# EAGLE design p2c-001 (EAGLE 9.6.2)
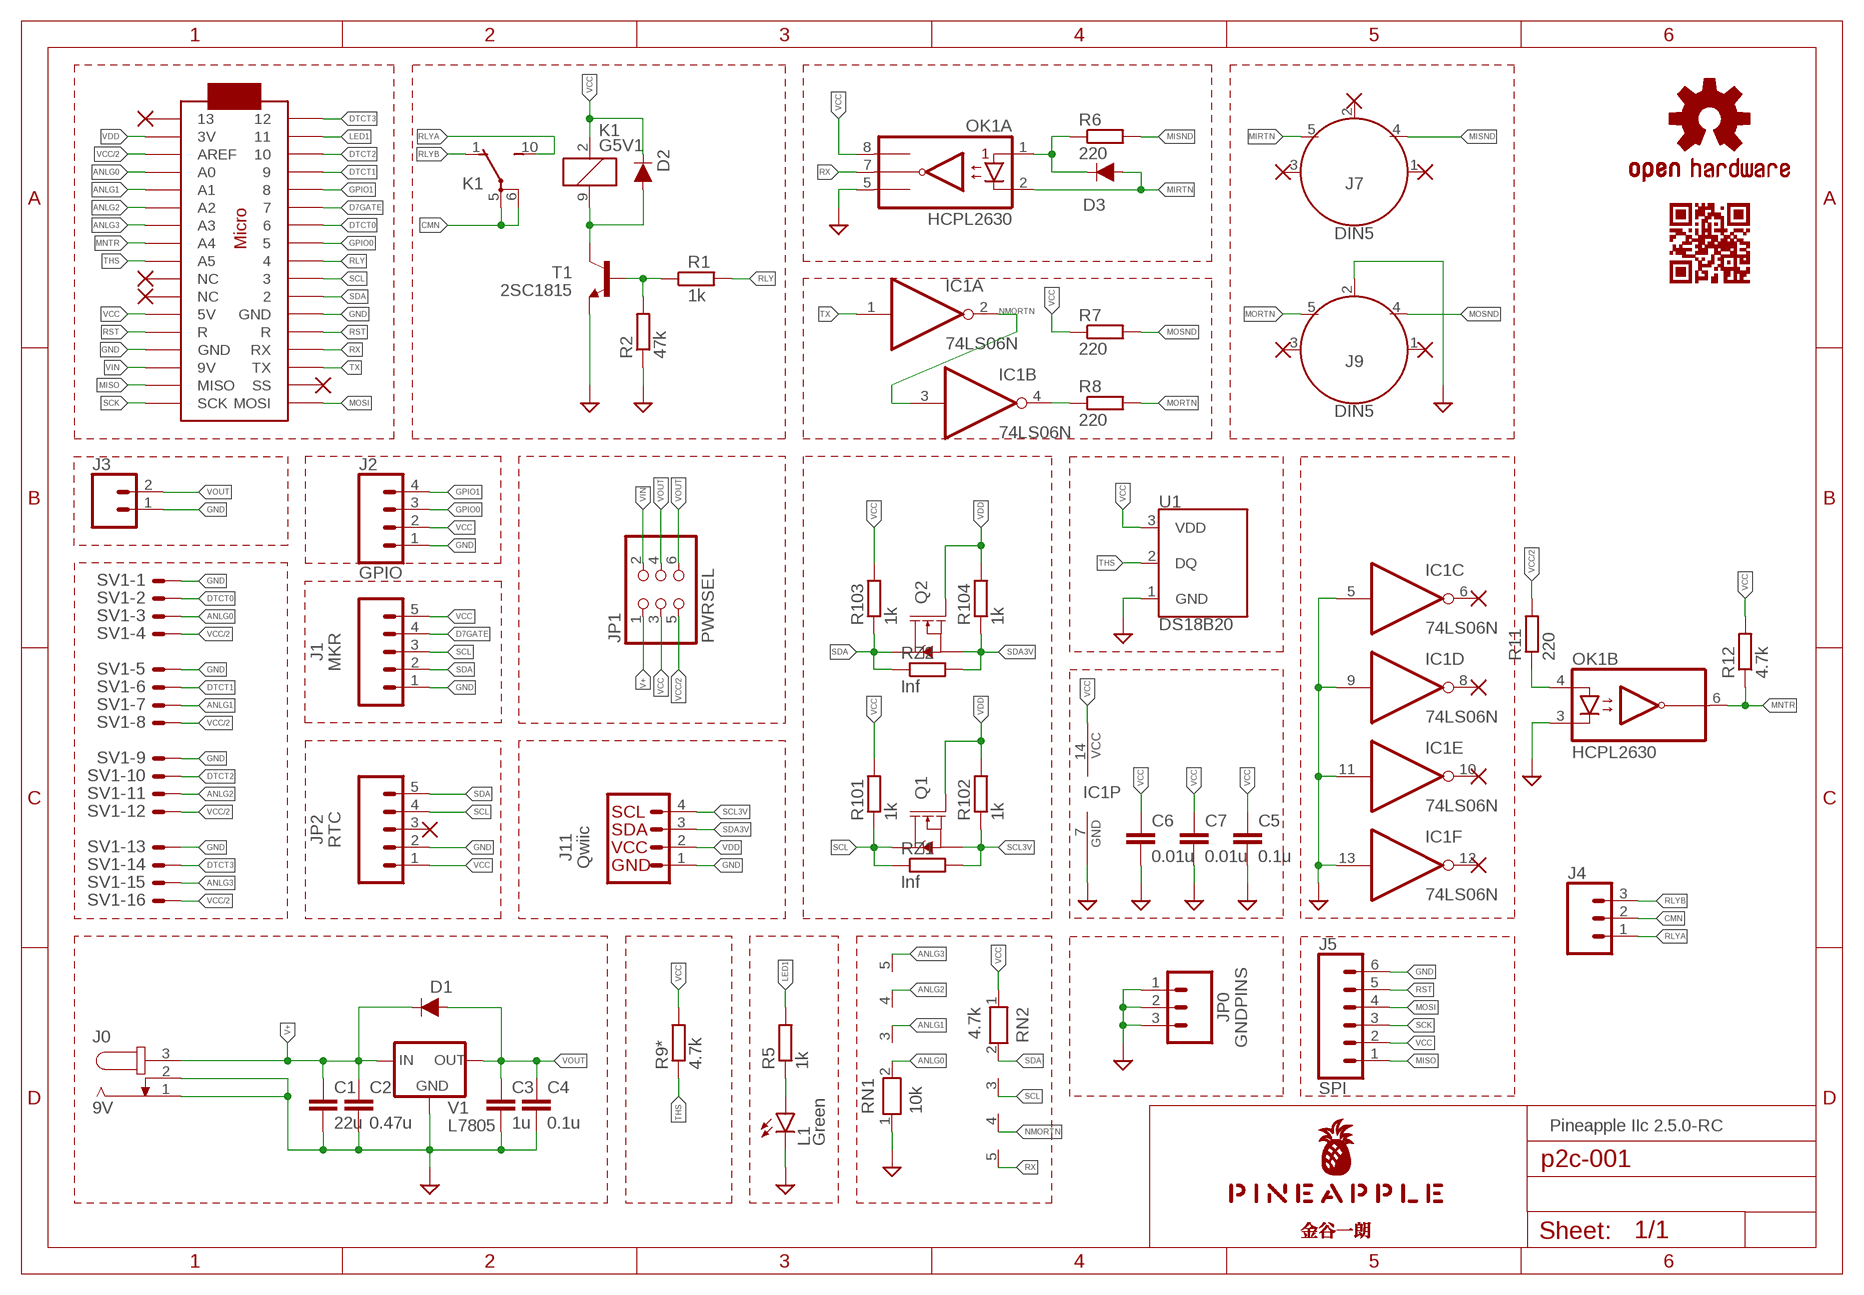
[diagram p0: schematic, sheet 1]

## Parts
C1  22u  C-EU025-050X050  [C025-050X050]
C2  0.47u  C-EU050-024X044  [C050-024X044]
C3  1u  C-EU050-024X044  [C050-024X044]
C4  0.1u  C-EU025-024X044  [C025-024X044]
C5  0.1u  C-EU025-024X044  [C025-024X044]
C6  0.01u  C-EU025-024X044  [C025-024X044]
C7  0.01u  C-EU025-024X044  [C025-024X044]
D1  DIODE-1N4148  [DIODE-1N4148]
D2  DIODE-1N4148  [DIODE-1N4148]
D3  DIODE-1N4148  [DIODE-1N4148]
IC1  74LS06N  [DIL14]
J0  9V  JACK-PLUG0  [SPC4077]
J1  MKR  CONN_05JST  [JST-5-PTH]
J2  GPIO  CONN_04JST-PTH  [JST-4-PTH]
J3  CONN_02JST-PTH-2  [JST-2-PTH]
J4  CONN_03JST-PTH-NS  [JST-3-PTH-NS]
J5  SPI  CONN_061.27MM  [1X06_1.27MM]
J7  DIN5  [DIN5-RA-PTH]
J9  DIN5  [DIN5-RA-PTH]
J11  Qwiic  QWIIC_CONNECTORJS-1MM  [1X04_1MM_RA]
JP0  GNDPINS  CONN_03  [1X03]
JP1  PWRSEL  PINHD-2X3  [2X03]
JP2  RTC  CONN_05  [1X05]
K1  G5V1  [G5V1]
L1  Green  LED3MM  [LED3MM]
LOGO1  OSHW-LOGOS-COPPER  [OSHW-LOGO-S_COPPER]
OK1  HCPL2630  [DIL08]
Q1  220mA/50V/3.5Ω  MOSFET-NCH-BSS138  [SOT23-3]
Q2  220mA/50V/3.5Ω  MOSFET-NCH-BSS138  [SOT23-3]
R1  1k  R-EU_0204/5  [0204/5]
R2  47k  R-EU_0204/5  [0204/5]
R5  1k  R-EU_0204/5  [0204/5]
R6  220  R-EU_0204/5  [0204/5]
R7  220  R-EU_0204/5  [0204/5]
R8  220  R-EU_0204/5  [0204/5]
R9*  4.7k  R-EU_0204/5  [0204/5]
R11  220  R-EU_0204/5  [0204/5]
R12  4.7k  R-EU_0204/5  [0204/5]
R101  1k  R-EU_R2012  [R2012]
R102  1k  R-EU_R2012  [R2012]
R103  1k  R-EU_R2012  [R2012]
R104  1k  R-EU_R2012  [R2012]
RN1  10k  RN04  [RN-5]
RN2  4.7k  RN04  [RN-5]
RZ1  Inf  R-EU_R2012  [R2012]
RZ2  Inf  R-EU_R2012  [R2012]
SV1  ML16LE  [ML16L]
T1  2SC1815  [TO92-ECB]
U1  DS18B20  [TO-92-AMMO]
U$1  PINEAPPLE450_SILK  [PINEAPPLE450_SILK]
U$2  ARDUINOMICRO  [ARDUINOMICRO]
U$3  KANAYA768_SILK  [KANAYA768_SILK]
U$4  CARDQRCODE450_SILK  [CARDQRCODE450_SILK]
V1  L7805  78XXS  [78XXS]

## Nets
ANLG0 [analog]: RN1.2 SV1.3 U$2.P$31(A0)
ANLG1 [analog]: RN1.3 SV1.7 U$2.P$30(A1)
ANLG2 [analog]: RN1.4 SV1.11 U$2.P$29(A2)
ANLG3 [analog]: RN1.5 SV1.15 U$2.P$28(A3)
CMN: J4.2 K1.5(2:P) K1.6(2:P)
D7GATE: J1.4 U$2.P$6
DTCT0: SV1.2 U$2.P$7
DTCT1: SV1.6 U$2.P$4
DTCT2: SV1.10 U$2.P$3
DTCT3: SV1.14 U$2.P$1
GND [ground]: C1.2 C2.2 C3.2 C4.2 C5.2 C6.2 C7.2 IC1.5(C:I) IC1.7(P:GND) IC1.9(D:I) IC1.11(E:I) IC1.13(F:I) J0.1 J0.2 J1.1 J2.1 J3.1 J5.6 J9.2 J11.1(GND) JP0.1 JP0.2 JP0.3 JP2.2 L1.K(C) OK1.3(B:C2) OK1.5(A:GND) R2.1 RN1.1 SV1.1 SV1.5 SV1.9 SV1.13 T1.E U1.1(GND) U$2.P$12(GND) U$2.P$21(GND) V1.GND
GPIO0: J2.3 U$2.P$8
GPIO1: J2.4 U$2.P$5
LED1: R5.2 U$2.P$2
LED1A: L1.A R5.1
MIA: D3.C OK1.1(A:A1) R6.1
MIRTN [external]: D3.A J7.5 OK1.2(A:C1)
MISND [external]: J7.4 R6.2
MISO: J5.1 U$2.P$19(MISO)
MNTR: OK1.6(B:VO2) R12.1 U$2.P$27(A4)
MNTRA [ground]: OK1.4(B:A2) R11.1
MORTN: J9.5 R8.2
MORTNRAW: IC1.4(B:O) R8.1
MOSI: J5.4 U$2.P$17(MOSI)
MOSND: J9.4 R7.2
NMORTN: IC1.2(A:O) IC1.3(B:I) RN2.4
RLY: R1.2 U$2.P$9
RLYA: J4.1 K1.10(2:S)
RLYB: J4.3 K1.1(2:O)
RLYC: D2.A K1.9 T1.C
RLYQ: R1.1 R2.2 T1.B
RST: J5.5 U$2.P$13(R) U$2.P$22(R)
RX: OK1.7(A:VO1) RN2.5 U$2.P$14(RX)
SCK: J5.3 U$2.P$18(SCK)
SCL: J1.3 JP2.4 Q1.3(D) R101.1 RN2.3 RZ1.1 U$2.P$10
SCL3V: J11.4(SCL) Q1.2(S) R102.1 RZ1.2
SDA: J1.2 JP2.5 Q2.3(D) R103.1 RN2.2 RZ2.1 U$2.P$11
SDA3V: J11.3(SDA) Q2.2(S) R104.1 RZ2.2
THS: R9*.1 U1.2(DQ) U$2.P$26(A5)
TX: IC1.1(A:I) U$2.P$15(TX)
V+ [power2]: C1.1 C2.1 D1.C J0.3 JP1.1 V1.IN
VCC [power1]: C5.1 C6.1 C7.1 D2.C IC1.14(P:VCC) J1.5 J2.2 J5.2 JP1.3 JP2.1 K1.2 OK1.8(A:VCC) R7.1 R9*.2 R12.2 R101.2 R103.2 RN2.1 U1.3(VDD) U$2.P$23(5V)
VCC/2 [power2]: JP1.5 R11.2 SV1.4 SV1.8 SV1.12 SV1.16 U$2.P$32(AREF)
VDD: J11.2(VCC) Q1.1(G) Q2.1(G) R102.2 R104.2 U$2.P$33(3V)
VIN [power2]: JP1.2 U$2.P$20(9V)
VOUT [power2]: C3.1 C4.1 D1.A J3.2 JP1.4 JP1.6 V1.OUT
Unconnected: IC1.6(C:O) IC1.8(D:O) IC1.10(E:O) IC1.12(F:O) J7.1 J7.2 J7.3 J9.1 J9.3 JP2.3 U$2.P$16(SS) U$2.P$24(NC) U$2.P$25(NC) U$2.P$34

## Notes on the sheet
- Pineapple IIc 2.5.0-RC

## Library data of the parts
C1-C5 = rcl:C-EU: CAPACITOR, European symbol; SPICEPREFIX: C
C6 C7 = resistor:C-EU: CAPACITOR, European symbol
D1-D3 = SparkFun-DiscreteSemi:DIODE: Diode These are standard reverse protection diodes and small signal diodes. SparkFun Products: SparkFun SparkPunk Sound Kit <https://www.sparkfun.com/products/11177> SparkFun ESP8266 Thing <https://www.sparkfun.com/products/13231>; PROD_ID: DIO-08378; VALUE: 200mA/100V/1V
IC1 = 74xx-us:74*06: Hex INVERTER, open collector high-voltage output
J0 = con-jack:JACK-PLUG: DC POWER JACK Power Jack, DC, Right Angle, Through Hole, Rated 5A at 16VDC, PC Terminals Distributor: Farnell (www.Farnell.de) Drawing: 84N1161.pdf / 84N1162.pdf Manufacturer: SPC Technology (www.spctechnology.com) Type: SPC4077 / SPC 4078; OC_FARNELL: unknown; OC_NEWARK: unknown
J1 = SparkFun-Connectors:CONN_05: Multi connection point. Often used as Generic Header-pin footprint for 0.1 inch spaced/style header connections On any of the 0.1 inch spaced packages, you can populate with these: Break Away Headers - Straight <https://www.sparkfun.com/products/116> (PRT-00116) Break Away Male Headers - Right Angle <https://www.sparkfun.com/products/553> (PRT-00553) Female Headers <https://www.sparkfun.com/products/115> (PRT-00115) Break Away Headers - Machine Pin <https://www.sparkfun.com/products/117> (PRT-00117) Break Away Female Headers - Swiss Machine Pin <https://www.sparkfun.com/products/743> (PRT-00743) For SCREWTERMINALS and SPRING TERMINALS visit here: Screw Terimnals on SparkFun.com <https://www.sparkfun.com/search/results?term=Screw+Terminals> (5mm/3.5mm/2.54mm spacing) This device is also useful as a general connection point to wire up your design to another part of your project. Our various solder wires solder well into these plated through hole pads. Hook-Up Wire - Assortment (Stranded, 22 AWG) <https://www.sparkfun.com/products/11375> (PRT-11375) Hook-Up Wire - Assortment (Solid Core, 22 AWG) <https://www.sparkfun.com/products/11367> (PRT-11367) View the entire wire category on our website here <https://www.sparkfun.com/categories/141> Special notes: Molex polarized connector foot print use with SKU : PRT-08231 with associated crimp pins and housings. 1MM SMD Version SKU: PRT-10208; SF_ID: PRT-09917
J2 = SparkFun-Connectors:CONN_04: Multi connection point. Often used as Generic Header-pin footprint for 0.1 inch spaced/style header connections On any of the 0.1 inch spaced packages, you can populate with these: Break Away Headers - Straight <https://www.sparkfun.com/products/116> (PRT-00116) Break Away Male Headers - Right Angle <https://www.sparkfun.com/products/553> (PRT-00553) Female Headers <https://www.sparkfun.com/products/115> (PRT-00115) Break Away Headers - Machine Pin <https://www.sparkfun.com/products/117> (PRT-00117) Break Away Female Headers - Swiss Machine Pin <https://www.sparkfun.com/products/743> (PRT-00743) For SCREWTERMINALS and SPRING TERMINALS visit here: Screw Terimnals on SparkFun.com <https://www.sparkfun.com/search/results?term=Screw+Terminals> (5mm/3.5mm/2.54mm spacing) This device is also useful as a general connection point to wire up your design to another part of your project. Our various solder wires solder well into these plated through hole pads. Hook-Up Wire - Assortment (Stranded, 22 AWG) <https://www.sparkfun.com/products/11375> (PRT-11375) Hook-Up Wire - Assortment (Solid Core, 22 AWG) <https://www.sparkfun.com/products/11367> (PRT-11367) View the entire wire category on our website here <https://www.sparkfun.com/categories/141> Special notes: Molex polarized connector foot print use with SKU : PRT-08231 with associated crimp pins and housings. 1MM SMD Version SKU: PRT-10208; PROD_ID: WIRE-13531; SF_ID: PRT-09916
J3 = SparkFun-Connectors:CONN_02: Multi connection point. Often used as Generic Header-pin footprint for 0.1 inch spaced/style header connections On any of the 0.1 inch spaced packages, you can populate with these: Break Away Headers - Straight <https://www.sparkfun.com/products/116> (PRT-00116) Break Away Male Headers - Right Angle <https://www.sparkfun.com/products/553> (PRT-00553) Female Headers <https://www.sparkfun.com/products/115> (PRT-00115) Break Away Headers - Machine Pin <https://www.sparkfun.com/products/117> (PRT-00117) Break Away Female Headers - Swiss Machine Pin <https://www.sparkfun.com/products/743> (PRT-00743) For SCREWTERMINALS and SPRING TERMINALS visit here: Screw Terimnals on SparkFun.com <https://www.sparkfun.com/search/results?term=Screw+Terminals> (5mm/3.5mm/2.54mm spacing) This device is also useful as a general connection point to wire up your design to another part of your project. Our various solder wires solder well into these plated through hole pads. Hook-Up Wire - Assortment (Stranded, 22 AWG) <https://www.sparkfun.com/products/11375> (PRT-11375) Hook-Up Wire - Assortment (Solid Core, 22 AWG) <https://www.sparkfun.com/products/11367> (PRT-11367) View the entire wire category on our website here <https://www.sparkfun.com/categories/141> Special notes: Molex polarized connector foot print use with: PRT-08233 with associated crimp pins and housings. 2.54_SCREWTERM for use with PRT-10571. 3.5mm Screw Terminal footprints for PRT-08084 5mm Screw Terminal footprints for use with PRT-08432; PROD_ID: CONN-09863; SKU: PRT-09914
J4 JP0 = SparkFun-Connectors:CONN_03: Multi connection point. Often used as Generic Header-pin footprint for 0.1 inch spaced/style header connections On any of the 0.1 inch spaced packages, you can populate with these: Break Away Headers - Straight <https://www.sparkfun.com/products/116> (PRT-00116) Break Away Male Headers - Right Angle <https://www.sparkfun.com/products/553> (PRT-00553) Female Headers <https://www.sparkfun.com/products/115> (PRT-00115) Break Away Headers - Machine Pin <https://www.sparkfun.com/products/117> (PRT-00117) Break Away Female Headers - Swiss Machine Pin <https://www.sparkfun.com/products/743> (PRT-00743) Stackable Header - 3 Pin (Female, 0.1") <https://www.sparkfun.com/products/13875> (PRT-13875) For SCREWTERMINALS and SPRING TERMINALS visit here: Screw Terimnals on SparkFun.com <https://www.sparkfun.com/search/results?term=Screw+Terminals> (5mm/3.5mm/2.54mm spacing) This device is also useful as a general connection point to wire up your design to another part of your project. Our various solder wires solder well into these plated through hole pads. Hook-Up Wire - Assortment (Stranded, 22 AWG) <https://www.sparkfun.com/products/11375> (PRT-11375) Hook-Up Wire - Assortment (Solid Core, 22 AWG) <https://www.sparkfun.com/products/11367> (PRT-11367) View the entire wire category on our website here <https://www.sparkfun.com/categories/141> Special notes: Molex polarized connector foot print use with SKU : PRT-08232 with associated crimp pins and housings.
J5 = SparkFun-Connectors:CONN_06: Multi connection point. Often used as Generic Header-pin footprint for 0.1 inch spaced/style header connections On any of the 0.1 inch spaced packages, you can populate with these: Break Away Headers - Straight <https://www.sparkfun.com/products/116> (PRT-00116) Break Away Male Headers - Right Angle <https://www.sparkfun.com/products/553> (PRT-00553) Female Headers <https://www.sparkfun.com/products/115> (PRT-00115) Break Away Headers - Machine Pin <https://www.sparkfun.com/products/117> (PRT-00117) Break Away Female Headers - Swiss Machine Pin <https://www.sparkfun.com/products/743> (PRT-00743) Arduino Stackable Header - 6 Pin <https://www.sparkfun.com/products/9280> (PRT-09280) For SCREWTERMINALS and SPRING TERMINALS visit here: Screw Terimnals on SparkFun.com <https://www.sparkfun.com/search/results?term=Screw+Terminals> (5mm/3.5mm/2.54mm spacing) This device is also useful as a general connection point to wire up your design to another part of your project. Our various solder wires solder well into these plated through hole pads. Hook-Up Wire - Assortment (Stranded, 22 AWG) <https://www.sparkfun.com/products/11375> (PRT-11375) Hook-Up Wire - Assortment (Solid Core, 22 AWG) <https://www.sparkfun.com/products/11367> (PRT-11367) View the entire wire category on our website here <https://www.sparkfun.com/categories/141>
J7 J9 = SparkFun-Connectors:DIN5: DIN5 Connector - Female Right Angle (frequently used as a MIDI Jack connector) This type of connector and cable is frequently used for transmitting midi data (musical instrument digital interface). It is what you usually see on a keyboard or set of electronic drums. Learn more here <https://en.wikipedia.org/wiki/MIDI>. For more information on the pinout and electrical specifications of MIDI communications, please see the following resource: https://www.midi.org/specifications/item/midi-din-electrical-specification Here is the connector we sell at SparkFun: MIDI Connector - Female Right Angle <https://www.sparkfun.com/products/9536> (PRT-09536) Datasheet <hhttp://www.sparkfun.com/datasheets/Prototyping/Connectors/MIDI-RA.pdf> It is used on this SparkFun product: SparkFun MIDI Shield <https://www.sparkfun.com/products/12898> (DEV-12898); PROD_ID: CONN-09481
J11 = SparkFun-Connectors:QWIIC_CONNECTOR: SparkFun I2C Standard Qwiic Connector An SMD 1mm pitch JST connector makes it easy and quick (get it? Qwiic?) to connect I2C devices to each other. The Qwiic system <http://www.sparkfun.com/qwiic> enables fast and solderless connection between popular platforms and various sensors and actuators. We carry 200mm <https://www.sparkfun.com/products/14204>, 100mm <https://www.sparkfun.com/products/14205>, 50mm <https://www.sparkfun.com/products/14206>, and breadboard friendly <https://www.sparkfun.com/products/14207> Qwiic cables. We also offer 10 pcs strips <https://www.sparkfun.com/products/14323> the SMD connectors.
JP1 = pinhead:PINHD-2X3: PIN HEADER
JP2 = SparkFun-Connectors:CONN_05: Multi connection point. Often used as Generic Header-pin footprint for 0.1 inch spaced/style header connections On any of the 0.1 inch spaced packages, you can populate with these: Break Away Headers - Straight <https://www.sparkfun.com/products/116> (PRT-00116) Break Away Male Headers - Right Angle <https://www.sparkfun.com/products/553> (PRT-00553) Female Headers <https://www.sparkfun.com/products/115> (PRT-00115) Break Away Headers - Machine Pin <https://www.sparkfun.com/products/117> (PRT-00117) Break Away Female Headers - Swiss Machine Pin <https://www.sparkfun.com/products/743> (PRT-00743) For SCREWTERMINALS and SPRING TERMINALS visit here: Screw Terimnals on SparkFun.com <https://www.sparkfun.com/search/results?term=Screw+Terminals> (5mm/3.5mm/2.54mm spacing) This device is also useful as a general connection point to wire up your design to another part of your project. Our various solder wires solder well into these plated through hole pads. Hook-Up Wire - Assortment (Stranded, 22 AWG) <https://www.sparkfun.com/products/11375> (PRT-11375) Hook-Up Wire - Assortment (Solid Core, 22 AWG) <https://www.sparkfun.com/products/11367> (PRT-11367) View the entire wire category on our website here <https://www.sparkfun.com/categories/141> Special notes: Molex polarized connector foot print use with SKU : PRT-08231 with associated crimp pins and housings. 1MM SMD Version SKU: PRT-10208
K1 = relay:G5V1: RELAY 1 x switch, 0.5 A/125 V AC, 1 A/24 V DC , Omron; MPN: G5V-1-DC24; OC_FARNELL: 9949593; OC_NEWARK: 36M6377
L1 = led:LED: LED OSRAM: - CHIPLED LG R971, LG N971, LY N971, LG Q971, LY Q971, LO R971, LY R971 LH N974, LH R974 LS Q976, LO Q976, LY Q976 LO Q996 - Hyper CHIPLED LW Q18S LB Q993, LB Q99A, LB R99A - SideLED LS A670, LO A670, LY A670, LG A670, LP A670 LB A673, LV A673, LT A673, LW A673 LH A674 LY A675 LS A676, LA A676, LO A676, LY A676, LW A676 LS A679, LY A679, LG A679 - Hyper Micro SIDELED® LS Y876, LA Y876, LO Y876, LY Y876 LT Y87S - SmartLED LW L88C, LW L88S LB L89C, LB L89S, LG L890 LS L89K, LO L89K, LY L89K LS L896, LA L896, LO L896, LY L896 - TOPLED LS T670, LO T670, LY T670, LG T670, LP T670 LSG T670, LSP T670, LSY T670, LOP T670, LYG T670 LG T671, LOG T671, LSG T671 LB T673, LV T673, LT T673, LW T673 LH T674 LS T676, LA T676, LO T676, LY T676, LB T676, LH T676, LSB T676, LW T676 LB T67C, LV T67C, LT T67C, LS T67K, LO T67K, LY T67K, LW E67C LS E67B, LA E67B, LO E67B, LY E67B, LB E67C, LV E67C, LT E67C LW T67C LS T679, LY T679, LG T679 LS T770, LO T770, LY T770, LG T770, LP T770 LB T773, LV T773, LT T773, LW T773 LH T774 LS E675, LA E675, LY E675, LS T675 LS T776, LA T776, LO T776, LY T776, LB T776 LHGB T686 LT T68C, LB T68C - Hyper Mini TOPLED® LB M676 - Mini TOPLED Santana® LG M470 LS M47K, LO M47K, LY M47K Source: http://www.osram.convergy.de LUXEON: - LUMILED® LXK2-PW12-R00, LXK2-PW12-S00, LXK2-PW14-U00, LXK2-PW14-V00 LXK2-PM12-R00, LXK2-PM12-S00, LXK2-PM14-U00 LXK2-PE12-Q00, LXK2-PE12-R00, LXK2-PE12-S00, LXK2-PE14-T00, LXK2-PE14-U00 LXK2-PB12-K00, LXK2-PB12-L00, LXK2-PB12-M00, LXK2-PB14-N00, LXK2-PB14-P00, LXK2-PB14-Q00 LXK2-PR12-L00, LXK2-PR12-M00, LXK2-PR14-Q00, LXK2-PR14-R00 LXK2-PD12-Q00, LXK2-PD12-R00, LXK2-PD12-S00 LXK2-PH12-R00, LXK2-PH12-S00 LXK2-PL12-P00, LXK2-PL12-Q00, LXK2-PL12-R00 Source: www.luxeon.com KINGBRIGHT: KA-3528ASYC Source: www.kingbright.com
LOGO1 = SparkFun-Aesthetics:OSHW-LOGO: Open-Source Hardware (OSHW) Logo This logo indicates the piece of hardware it is found on incorporates a OSHW license and/or adheres to the definition of open source hardware found here: http://freedomdefined.org/OSHW
OK1 = optocoupler:HCPL2630: HEWLETT PACKARD OPTO COUPLER; MF: AGILENT TECHNOLOGIES; MPN: HCPL-2630-000E; OC_FARNELL: 9994904; OC_NEWARK: 88H7813
Q1 Q2 = SparkFun-DiscreteSemi:MOSFET-NCH: N-channel MOSFETs Voltage controlled devices that allow control of high current outputs. SparkFun Products: SparkFun OpenScale <https://www.sparkfun.com/products/13261> SparkFun Digital Sandbox <https://www.sparkfun.com/products/12651> SparkFun Monster Moto Shield <https://www.sparkfun.com/products/10182> SparkFun MOSFET Power Controller <https://www.sparkfun.com/products/11214>; PROD_ID: TRANS-00830
R1 R2 R5-R8 R9* R11 R12 R101-R104 RZ1 RZ2 = resistor:R-EU_: RESISTOR, European symbol
RN1 RN2 = resistor-net:RN04: RESISTOR NETWORK; OC_FARNELL: unknown; OC_NEWARK: unknown
SV1 = con-ml:ML16LE: HARTING; OC_FARNELL: unknown; OC_NEWARK: unknown
T1 = transistor:2SC1815: NPN EPITAXIAL TRANSISTOR Source: TOSHIBA .. 2SC1815 1.pdf
U1 = SparkFun-Sensors:DS18B20: Dallas/Maxim DS18B20 1-Wire Temperature Sensor The DS18B20 reports degrees C with 9 to 12-bit precision, -55C to 125C (+/-0.5C). Each sensor has a unique 64-Bit Serial number etched into it - allows for a huge number of sensors to be used on one data bus. Datasheet <http://datasheets.maximintegrated.com/en/ds/DS18B20.pdf> SparkFun Products One Wire Digital Temperature Sensor - DS18B20 <https://www.sparkfun.com/products/245> (SEN-00245); STORE_ID: SEN-00245
U$1 = pineapple:PINEAPPLE450_SILK
U$2 = adafruit:ARDUINOMICRO
U$3 = pineapple:KANAYA768_SILK
U$4 = pineapple:CARDQRCODE450_SILK
V1 = v-reg:78XXS: VOLTAGE REGULATOR

## Net classes
0 default: width 0.152 mm, drill 0.152 mm, clearance 0.152 mm
1 ground: width 0.305 mm, drill 0.152 mm, clearance 0.152 mm
2 power1: width 0.508 mm, drill 0.152 mm, clearance 0.152 mm
3 power2: width 0.61 mm, drill 0.152 mm, clearance 0.152 mm
4 analog: width 0.305 mm, drill 0.152 mm, clearance 0.152 mm
5 external: width 0.152 mm, drill 0.152 mm, clearance 0.152 mm

## Board
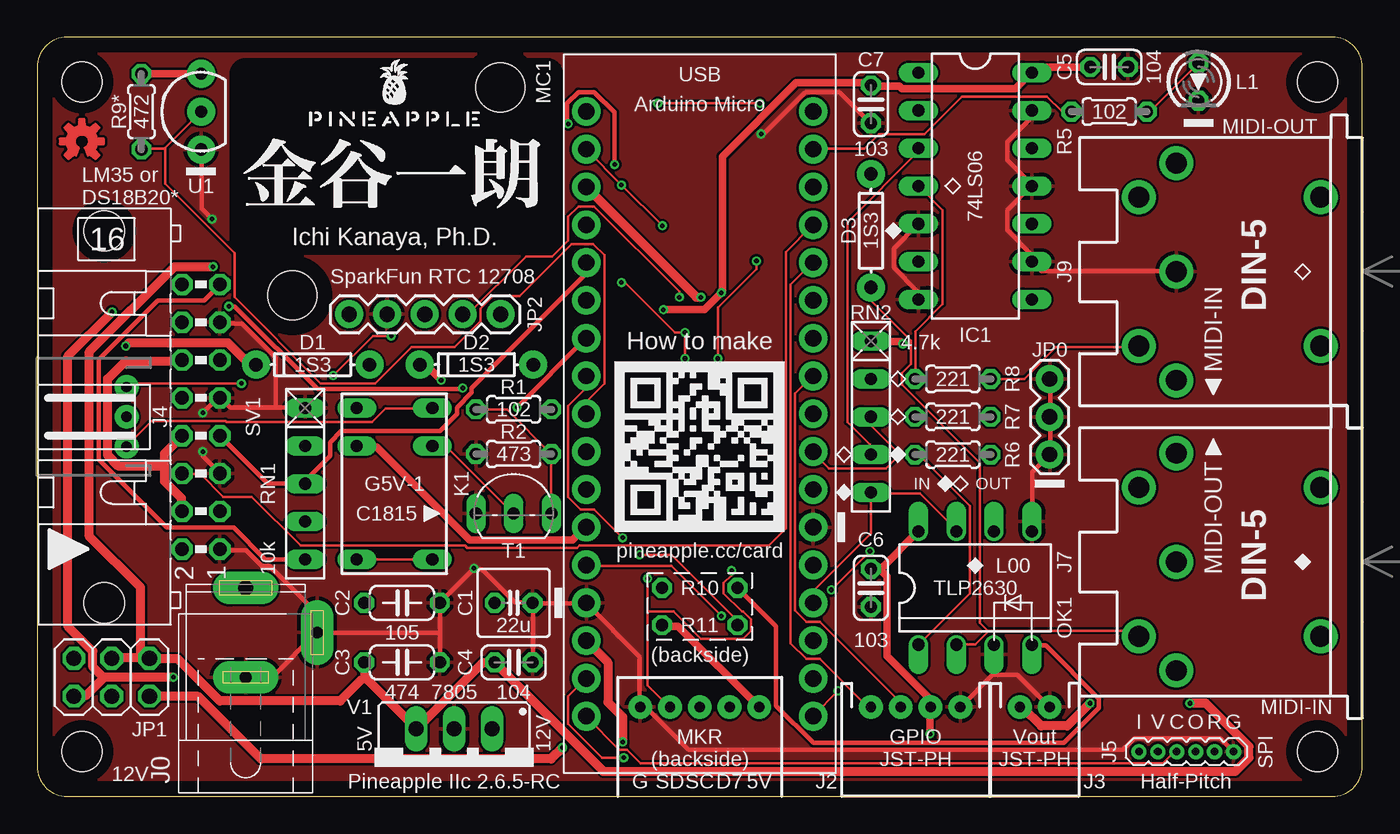
[diagram p1: board, top side]
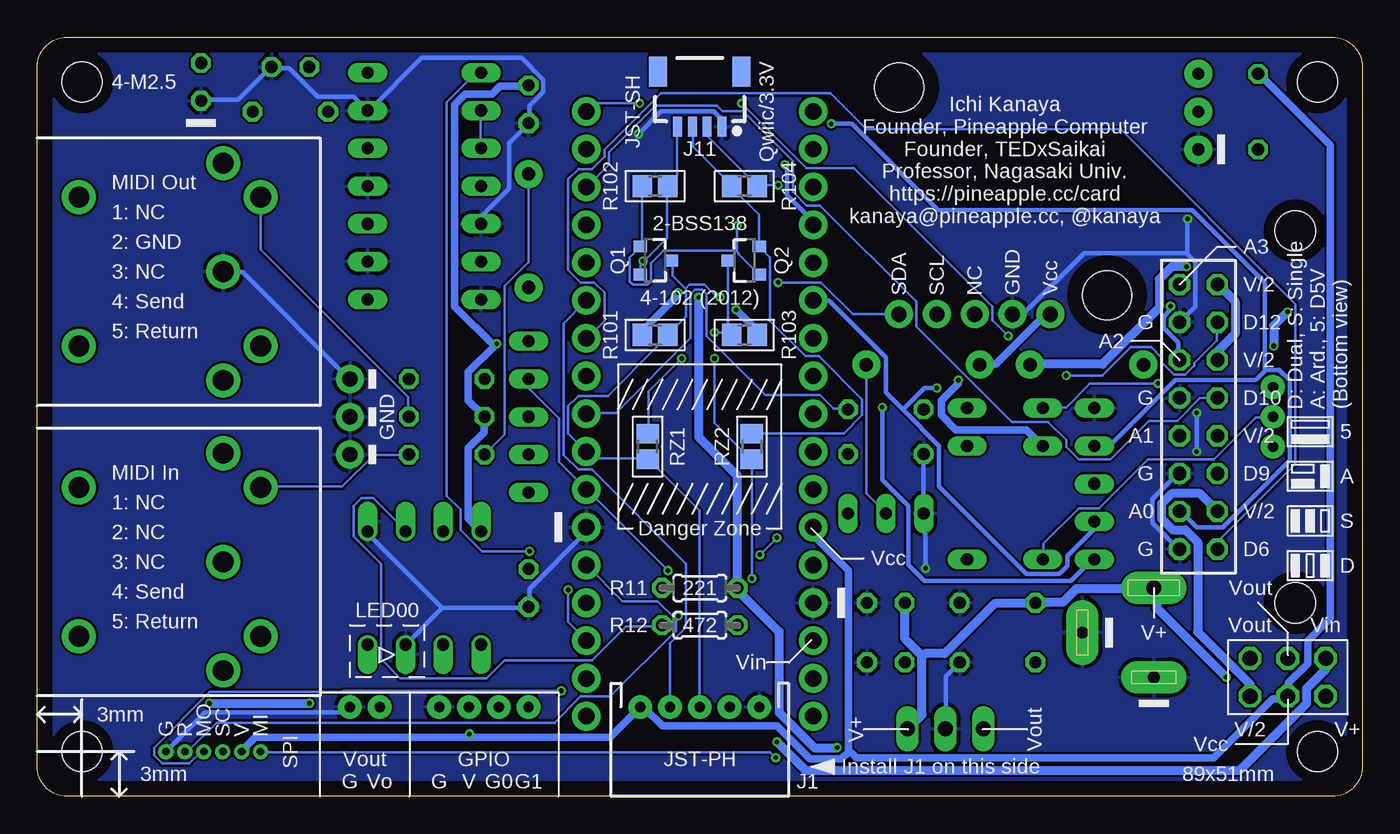
[diagram p2: board, bottom side, seen from below]

Size 89 x 51 mm. Coordinates in mm from the lower left corner, seen from the top.
Outline: 0,49 0,2 arc90 2,0 87,0 arc90 89,2 89,49 arc90 87,51 2,51 arc90 0,49
Copper layers (1*16): Top 0.035mm / dielectric 1.5mm / Bottom 0.035mm
Design rules "SeeedStudio_2layer_DRU_no_angle_20140221": minimum track width 6mil, minimum drill 12mil, track to track 6mil, track to pad 6mil, pad to pad 6mil, via to via 6mil, smd to smd 0mil, copper to edge 10mil, drill to drill 10mil, minimum pad ring 10mil, minimum via ring 6mil, stop-mask expansion 2mil, vias tented up to drill 100mil, thermal gap 10mil
Holes 2.7 mm at 3,3 3,48 86,48 86,3 4.5,13 4.5,38
tRestrict: area 0,0 to 89,1; area 88,0 to 89,51; area 0,50 to 89,51; area 0,0 to 1,51; area 1,46 to 5,50; area 1,1 to 5,5; area 84,1 to 88,5; area 84,46 to 88,50; area 13,36.5 to 35.2,49.5; area 39,18 to 50,29; area 2.5,11 to 6.5,15; area 2.5,36 to 6.5,40; 2 more areas
bRestrict: area 0,0 to 89,1; area 88,0 to 89,51; area 0,50 to 89,51; area 0,0 to 1,51; area 84,46 to 88,50; area 84,1 to 88,5; area 1,46 to 5,50; area 1,1 to 5,5; area 2.5,11 to 6.5,15; area 2.5,36 to 6.5,40; area 14.5,31.1 to 19.7,36.3; area 28.5,45 to 33.7,50.2

### Footprints (pad centres in the part's own frame; a part is rotated, then mirrored left to right if it is on the bottom)
C025-050X050 = drill 0.813 octagon: 1 -1.27,0; 2 1.27,0
C050-024X044 = drill 0.813 octagon: 1 -2.54,0; 2 2.54,0
C025-024X044 = drill 0.813 octagon: 1 -1.27,0; 2 1.27,0
DIODE-1N4148 = drill 0.9 pad 1.88: A -3.81,0; C 3.81,0
DIL14 = drill 0.813 long: 1 -7.62,-3.81; 2 -5.08,-3.81; 3 -2.54,-3.81; 4 0,-3.81; 5 2.54,-3.81; 6 5.08,-3.81; 7 7.62,-3.81; 8 7.62,3.81; 9 5.08,3.81; 10 2.54,3.81; 11 0,3.81; 12 -2.54,3.81; 13 -5.08,3.81; 14 -7.62,3.81
SPC4077 = drill 0.8 pad 2.184 long: 1 -3,0; 2 0,-4.8 | drill 1 pad 2.184 long: 3 3,0
JST-5-PTH = drill 0.7 pad 1.6: 1 -4,0; 2 -2,0; 3 0,0; 4 2,0; 5 4,0
JST-4-PTH = drill 0.7 pad 1.6: 1 -3,0; 2 -1,0; 3 1,0; 4 3,0
JST-2-PTH = drill 0.7 pad 1.6: 1 -1,0; 2 1,0
JST-3-PTH-NS = drill 0.7 pad 1.6: 1 -2,0; 2 0,0; 3 2,0
1X06_1.27MM = drill 0.508 pad 1: 1 0,0; 2 1.27,0; 3 2.54,0; 4 3.81,0; 5 5.08,0; 6 6.35,0
DIN5-RA-PTH = drill 1.4 pad 2.286: 1 7.3,12.5; 2 0,12.5; 3 -7.3,12.5; 4 5,15; 5 -5,15; 6 -5,2.8; 7 5,2.8
1X04_1MM_RA = smd 0.6 x 1.35: 1 -1.5,0; 2 -0.5,0; 3 0.5,0; 4 1.5,0 | smd 1.2 x 2: NC1 2.8,-3.675; NC2 -2.8,-3.675
1X03 = drill 1.016 pad 1.88: 1 0,0; 2 2.54,0; 3 5.08,0
2X03 = drill 1.016 octagon: 1 -2.54,-1.27; 2 -2.54,1.27; 3 0,-1.27; 4 0,1.27; 5 2.54,-1.27; 6 2.54,1.27
1X05 = drill 1.016 pad 1.88: 1 0,0; 2 2.54,0; 3 5.08,0; 4 7.62,0; 5 10.16,0
G5V1 = drill 0.813 long: 1 -5.08,-2.54; 2 -2.54,-2.54; 5 5.08,-2.54; 6 5.08,2.54; 9 -2.54,2.54; 10 -5.08,2.54
LED3MM = drill 0.813 octagon: A -1.27,0; K 1.27,0
DIL08 = drill 0.813 offset: 1 -3.81,-3.81; 2 -1.27,-3.81; 3 1.27,-3.81; 4 3.81,-3.81; 5 3.81,3.81; 6 1.27,3.81; 7 -1.27,3.81; 8 -3.81,3.81
SOT23-3 = smd 0.8 x 0.9: 1 -0.95,-1; 2 0.95,-1; 3 0,1.1
0204/5 = drill 0.813 octagon: 1 -2.54,0; 2 2.54,0
R2012 = smd 1.3 x 1.5: 1 -0.85,0; 2 0.85,0
RN-5 = drill 0.813 long: 1 -5.08,0; 2 -2.54,0; 3 0,0; 4 2.54,0; 5 5.08,0
ML16L = drill 0.914 octagon: 1 -8.89,-1.27; 2 -8.89,1.27; 3 -6.35,-1.27; 4 -6.35,1.27; 5 -3.81,-1.27; 6 -3.81,1.27; 7 -1.27,-1.27; 8 -1.27,1.27; 9 1.27,-1.27; 10 1.27,1.27; 11 3.81,-1.27; 12 3.81,1.27; 13 6.35,-1.27; 14 6.35,1.27; 15 8.89,-1.27; 16 8.89,1.27
TO92-ECB = drill 0.813 long: B 2.54,0; C 0,0; E -2.54,0
TO-92-AMMO = drill 0.813 pad 1.88: 1 -2.54,0; 2 0,0; 3 2.54,0
ARDUINOMICRO = drill 1.1 pad 1.93: P$1 -20.32,7.62; P$2 -17.78,7.62; P$3 -15.24,7.62; P$4 -12.7,7.62; P$5 -10.16,7.62; P$6 -7.62,7.62; P$7 -5.08,7.62; P$8 -2.54,7.62; P$9 0,7.62; P$10 2.54,7.62; P$11 5.08,7.62; P$12 12.7,-7.62; P$13 10.16,-7.62; P$14 12.7,7.62; P$15 15.24,7.62; P$16 17.78,7.62; P$17 20.32,7.62; P$18 20.32,-7.62; P$19 17.78,-7.62; P$20 15.24,-7.62; P$21 7.62,7.62; P$22 10.16,7.62; P$23 7.62,-7.62; P$24 5.08,-7.62; P$25 2.54,-7.62; P$26 0,-7.62; P$27 -2.54,-7.62; P$28 -5.08,-7.62; P$29 -7.62,-7.62; P$30 -10.16,-7.62; P$31 -12.7,-7.62; P$32 -15.24,-7.62; P$33 -17.78,-7.62; P$34 -20.32,-7.62
STAND-OFF = hole 3.302: 0,0
78XXS = drill 1.016 long: GND 0,-2.54; IN -2.54,-2.54; OUT 2.54,-2.54

### Placement (x,y rotation side)
C1  32,13 0 top
C2  24.5,13 0 top
C3  24.5,9 0 top
C4  32,9 0 top
C5  72,49 0 top
C6  56,14 270 top
C7  56,46.5 270 top
D1  18.5,29 180 top
D2  29.5,29 180 top
D3  56,38 90 top
IC1  63,41 270 top
J0  14,11 90 top
J1  44.5,6 180 bottom
J2  59,6 180 top
J3  67,6 180 top
J4  6,25.5 90 top
J5  74,3 0 top
J7  89,15.75 90 top
J9  89,35.25 90 top
J11  44.5,45 180 bottom
JP0  68,22.96 90 top
JP1  5,8 0 top
JP2  20.95,32.38 0 top
K1  24,21 270 top
L1  78,48 270 top
LOGO1  3,44 0 top
OK1  63,14 0 top
Q1  47.5,36 270 bottom
Q2  41.5,36 90 bottom
R1  32,26 0 top
R2  32,23 0 top
R5  72,46 180 top
R6  61.5,22.96 0 top
R7  61.5,25.5 0 top
R8  61.5,28.04 0 top
R9*  7,46 90 top
R11  44.5,14 0 bottom
R12  44.5,11.5 0 bottom
R101  47.5,31 180 bottom
R102  47.5,41 180 bottom
R103  41.5,31 0 bottom
R104  41.5,41 0 bottom
RN1  18,21 270 top
RN2  56,25.5 270 top
RZ1  48,23.5 90 bottom
RZ2  41,23.5 90 bottom
SV1  11,25.5 90 top
T1  32,19 0 top
U1  11,46 90 top
U$1  24,45 0 top
U$2  44.5,25.7 270 top
U$3  24,39.5 0 top
U$4  44.5,23.5 0 top
U$5  [STAND-OFF]  17.14,33.66 0 top
U$6  [STAND-OFF]  31.11,47.62 0 top
V1  28,2 180 top

### Tracks (layer width: path | path; a pad name or v marks a point on that pad's centre or on a via)
ANLG0  (via drill 0.3)
  Top 0.305: v38.79,42.44 38.79,45.95 37.41,47.32 36.35,47.32 35.59,46.56 35.59,45.26 v35.66,45.19
  Bottom 0.305: 6.48,28.65 7.16,27.96 12.57,27.96 16.99,23.55 17.98,23.55 RN1.2 | 6.48,28.65 5.56,28.65 4.88,27.96 4.88,22.55 9.37,18.06 11.12,18.06 12.27,19.2 SV1.3 | v38.79,42.44 38.63,42.29 38.63,40.39 36.88,38.63 U$2.P$31 | v35.66,45.19 34.29,45.19 28.5,39.4 11.43,39.4 6.55,34.52 6.55,28.73 6.48,28.65
ANLG1
  Top 0.305: SV1.7 12.34,24.16 15.47,21.03 17.98,21.03 RN1.3 17.98,21.18 19.66,22.86 19.66,23.77 20.42,24.54 27.05,24.54 28.19,25.68 28.19,26.14 29.18,27.13 29.18,27.43 36.8,35.05 36.8,35.81 U$2.P$30
ANLG2  (via drill 0.3)
  Top 0.305: v12.88,32.92 13.26,32.92 18.82,27.36 28.5,27.36 v28.57,27.43
  Bottom 0.305: 30.86,25.98 32,27.13 32,29.49 35.81,33.3 36.8,33.3 U$2.P$29 | 30.86,25.98 28.42,23.55 28.42,20.8 22.55,14.94 20.34,14.94 19.81,15.47 19.81,16.15 18.06,17.91 18.06,18.44 RN1.4 | v12.88,32.92 12.88,32.69 13.34,32.23 13.34,31.47 12.34,30.48 12.34,29.34 SV1.11 | v28.57,27.43 29.41,27.43 30.86,25.98
ANLG3  (via drill 0.3)
  Top 0.305: RN1.5 17.98,15.93 15.32,15.93 13.18,18.06 8.69,18.06 4.12,22.63 4.12,29.34 8.08,33.3 11.2,33.3 12.27,34.37 SV1.15 | v32.23,26.14 36.8,30.71 U$2.P$28
  Bottom 0.305: v32.23,26.14 32.23,21.26 30.48,19.51 30.48,15.54 29.41,14.48 19.58,14.48 18.21,15.85 18.06,15.85 RN1.5
CMN
  Top 0.152: K1.5 21.49,15.93 26.52,15.93 K1.6
  Bottom 0.152: J4.2 6.02,25.45 7.16,25.45 9.98,22.63 14.4,22.63 17.68,19.36 19.05,19.36 21.41,16.99 21.41,15.93 K1.5
D7GATE
  Bottom 0.152: J1.4 46.48,6.02 46.48,10.29 45.41,11.35 45.41,15.62 51.74,21.95 52.65,21.95 53.65,22.94 53.65,31.77 52.12,33.3 U$2.P$6
DTCT0
  Bottom 0.152: SV1.2 9.68,16.61 9.68,17.14 4.5,22.33 4.5,33.07 16.23,44.81 33.3,44.81 35.74,47.24 47.09,47.24 50.9,43.43 50.9,42.98 51.74,42.14 52.65,42.14 53.34,41.45 53.34,35.36 52.5,34.52 51.59,34.52 50.9,33.83 50.9,31.93 52.05,30.79 U$2.P$7
DTCT1
  Top 0.152: SV1.6 9.75,21.64 10.97,21.64 12.5,20.12 14.4,20.12 17.68,16.84 28.73,16.84 28.88,16.69 36.27,16.69 36.42,16.84 49.15,16.84 50.29,17.98 50.29,36.58 52.05,38.33 U$2.P$4
DTCT2
  Bottom 0.152: SV1.10 9.75,26.75 10.9,26.75 12.42,25.22 14.33,25.22 16.92,22.63 19.05,22.63 19.89,23.47 19.89,23.93 21.11,25.15 23.55,25.15 29.95,31.55 29.95,33.22 36.42,39.7 37.34,39.7 38.25,40.62 38.25,42.67 41.6,46.02 42.98,46.02 43.36,46.41 47.47,46.41 50.6,43.28 50.6,42.44 52.05,41 U$2.P$3
DTCT3  (via drill 0.3)
  Top 0.152: v19.89,28.27 22.55,30.94 v23.77,30.94 | v48.54,46.56 v41.68,46.56
  Bottom 0.152: v19.89,28.27 17.45,28.27 15.54,30.18 14.17,30.18 13.49,29.49 13.49,29.18 12.65,28.35 11.89,28.35 11.28,28.96 11.28,29.11 9.75,30.63 9.75,31.77 SV1.14 | v23.77,30.94 24.84,32 24.84,32.92 34.14,42.22 37.34,42.22 v41.68,46.56 | v48.54,46.56 51.51,46.56 52.05,46.02 U$2.P$1
GND  (via drill 0.3)
  Top 0.305: 16,26.14 12.95,26.14 12.34,26.75 SV1.9 12.12,26.75 v11.12,25.76 | 16,26.14 17.98,26.14 RN1.1 | 16,26.14 16,29.49 13.72,31.77 12.34,31.77 SV1.13 | v11.73,38.79 11.05,39.47 11.05,43.43 U1.1 | J0.1 14.02,8 15.77,8 18.75,10.97 J0.2 | SV1.1 12.34,16.54 14.02,16.54 15.09,15.47 15.62,15.47 18.75,12.34 18.75,11.12 J0.2 | C4.2 33.3,9.07 33.3,12.95 C1.2 | C1.2 33.45,12.95 36.73,12.95 U$2.P$12 36.88,12.95 40.46,9.37 40.46,6.02 J1.1 40.62,5.94 40.92,5.94 43.74,3.12 72.92,3.12 73.69,3.89 79.48,3.89 80.31,3.05 J5.6 | 27.05,10.97 27.05,12.95 C2.2 27.13,13.11 v29.34,15.32 29.41,15.24 29.87,15.24 32.08,13.03 33.15,13.03 C1.2 | 27.05,10.97 27.05,9.07 C3.2 | 27.05,10.97 18.9,10.97 J0.2 | v11.12,23.16 11.12,22.86 12.27,21.72 SV1.5 | IC1.7 59.13,33.45 59.13,33.91 57.53,35.51 57.53,36.8 59.13,38.41 IC1.5 | v48.62,44.5 48.77,44.5 51.59,47.32 53.87,47.32 55.93,45.26 C7.2 | IC1.13 66.75,46.02 66.75,45.57 65.15,43.97 65.15,42.75 66.75,41.15 IC1.11 66.75,41 65.15,39.4 65.15,38.02 66.75,36.42 66.75,35.97 IC1.9 66.9,35.81 67.44,35.28 76.43,35.28 J9.2 | OK1.5 66.83,17.83 66.83,21.79 67.97,22.94 JP0.1 68.05,23.09 68.05,25.45 JP0.2 68.05,25.6 68.05,27.96 JP0.3 | 64.24,8.23 64.24,10.13 OK1.3 | 64.24,8.23 62.03,6.02 J2.1 | 64.24,8.23 64.31,8.15 65.84,8.15 67.97,6.02 J3.1
  Bottom 0.305: JP2.2 22.78,32.38 18.67,36.5 11.81,36.5 | 11.81,36.5 11.2,35.89 11.2,32.92 SV1.13 | v11.73,38.79 11.73,36.58 11.81,36.5 | SV1.1 12.34,16.61 14.1,18.36 14.1,19.96 12.34,21.72 SV1.5 | R2.1 29.49,22.94 29.49,19.05 T1.E 29.34,18.9 v29.34,15.32 | V1.GND 27.96,4.57 27.96,8.08 C3.2 | v11.12,23.16 v11.12,25.76 | v48.62,44.5 47.09,46.02 43.59,46.02 43.05,45.49 43.05,45.03 J11.1 | IC1.5 59.13,38.48 59.13,39.01 57.3,40.84 57.3,43.89 56.01,45.19 C7.2 55.93,45.34 55.93,46.41 55.02,47.32 55.02,48.16 56.46,49.61 63.17,49.61 66.67,46.1 IC1.13 66.83,46.1 67.74,47.02 70.18,47.02 72.08,48.92 73.15,48.92 C5.2 73.3,49 75.51,46.79 77.95,46.79 L1.K | U$2.P$21 52.12,18.06 52.12,17.75 55.93,13.95 55.93,12.8 C6.2 56.08,12.65 61.8,12.65 | J5.6 80.31,3.05 77.72,5.64 68.35,5.64 68.05,5.94 J3.1 | 61.8,12.65 64.24,10.21 OK1.3 | 61.8,12.65 66.75,17.6 66.75,17.75 OK1.5 | J9.2 76.43,35.2 75.21,35.2 68.05,28.04 JP0.3
  pour Top: -1,-1 90,-1 90,52 -1,52
  pour Bottom: -2,-2 91,-2 91,53 -2,53
GPIO0
  Top 0.152: J2.3 57.99,6.02 57.99,6.33 52.58,11.73 51.66,11.73 50.9,12.5 50.9,27.05 52.05,28.19 U$2.P$8
GPIO1
  Top 0.152: J2.4 55.93,6.02 55.78,6.02 52.58,9.22 51.66,9.22 50.6,10.29 50.6,34.37 52.05,35.81 U$2.P$5
LED1
  Top 0.152: R5.2 69.42,46.02 68.81,46.02 67.82,47.02 62.1,47.02 59.59,44.5 56.54,44.5 55.55,43.51 52.12,43.51 U$2.P$2
LED1A
  Top 0.152: R5.1 74.6,46.02 74.75,46.02 77.95,49.23 L1.A
MIA
  Top 0.152: R6.1 58.98,22.94 59.21,22.94 62.64,19.51 62.64,13.64 59.21,10.21 OK1.1
  Bottom 0.152: D3.C 56.01,41.76 56.01,35.89 57.61,34.29 57.61,24.31 58.9,23.01 R6.1
MIRTN
  Top 0.152: 63.89,11.09 63.93,11.12 73.69,11.12 73.99,10.82 J7.5 | 63.89,11.09 63.02,10.21 61.8,10.21 OK1.2 | 63.89,11.09 63.32,11.66 63.32,22.4 58.06,27.66 58.06,28.42 58.67,29.03 58.67,30.63 56.01,33.3 56.01,34.14 D3.A
MISND
  Bottom 0.152: R6.2 64.08,22.94 66.37,22.94 68.5,20.8 73.99,20.8 J7.4
MISO  (via drill 0.3)
  Top 0.152: v39.4,2.59 37.95,2.59 35.66,4.88 35.66,6.71 36.8,7.85 U$2.P$19
  Bottom 0.152: v39.4,2.59 39.78,2.97 73.99,2.97 J5.1
MNTR  (via drill 0.3)
  Top 0.152: v39.32,17.37 37.41,19.28 36.5,19.28 35.66,20.12 35.66,26.21 36.8,27.36 36.8,28.19 U$2.P$27 | v40.46,16.23 42.6,16.23 47.02,11.81 47.02,11.51 R12.1
  Bottom 0.152: R12.1 47.09,11.43 49.45,11.43 51.74,9.14 57.61,9.14 58.83,7.92 64.62,7.92 65.91,9.22 65.91,15.62 67.74,17.45 67.74,19.51 67.21,20.04 66.45,20.04 64.24,17.83 OK1.6 | v40.46,16.23 v39.32,17.37
MNTRA
  Top 0.305: OK1.4 66.83,10.13 67.74,10.13 71.32,6.55 71.32,5.94 68.96,3.58 52.12,3.58 49.61,6.1 49.61,11.43 47.09,13.95 R11.1
MORTN
  Top 0.152: R8.2 64.08,28.04 66.29,28.04 68.43,30.18 73.99,30.18 J9.5
MORTNRAW
  Top 0.152: R8.1 58.98,28.04 58.98,31.24 60.81,33.07 60.81,39.4 59.21,41 IC1.4
MOSI  (via drill 0.3)
  Top 0.152: v53.8,7.09 52.12,5.41 U$2.P$17
  Bottom 0.152: v53.8,7.09 68.43,7.09 68.5,7.01 77.42,7.01 81.15,3.28 81.15,2.74 80.62,2.21 78.79,2.21 78.03,2.97 77.88,2.97 J5.4
MOSND
  Bottom 0.152: R7.2 64.08,25.53 64.08,26.82 73.99,36.73 73.99,40.23 J9.4
NMORTN
  Top 0.152: RN2.4 55.93,23.01 55.93,23.62 54.41,25.15 54.41,38.56 59.13,43.28 59.13,43.51 IC1.3
  Bottom 0.152: IC1.2 59.21,46.02 59.21,43.59 IC1.3
RLY
  Bottom 0.152: R1.2 34.59,26.06 35.51,26.06 36.42,26.98 40.08,26.98 44.04,30.94 44.04,33.76 44.35,34.06 44.81,34.06 45.11,33.76 45.11,30.79 50.14,25.76 52.05,25.76 U$2.P$9
RLYA
  Top 0.152: K1.10 26.52,26.06 23.39,26.06 22.48,25.15 12.72,25.15 12.65,25.22 7.7,25.22 6.02,23.55 J4.1
RLYB  (via drill 0.3)
  Top 0.152: v13.72,27.74 6.25,27.74 6.02,27.51 J4.3
  Bottom 0.152: v13.72,27.74 18.29,27.74 19.89,26.14 21.41,26.14 K1.1
RLYC
  Top 0.152: K1.9 26.59,23.47 27.51,23.47 31.93,19.05 T1.C
  Bottom 0.152: D2.A 33.3,28.96 33.3,20.34 32,19.05 T1.C
RLYQ
  Top 0.152: R1.1 29.49,25.98 31.55,25.98 34.52,23.01 R2.2 34.52,22.94 34.52,19.05 T1.B
RST  (via drill 0.3)
  Top 0.152: v45.95,12.12 42.6,15.47 36.88,15.47 U$2.P$13
  Bottom 0.152: 46.14,11.93 47.32,13.11 49.68,13.11 52.05,15.47 U$2.P$22 | 46.14,11.93 46.1,11.89 46.1,11.12 50.52,6.71 52.5,6.71 54.25,4.95 76.96,4.95 78.87,3.05 79.02,3.05 J5.5 | 46.14,11.93 v45.95,12.12
RX
  Top 0.152: OK1.7 61.8,17.83 59.28,20.34 56.01,20.34 RN2.5 56.01,20.27 56.01,17.68 52.12,13.79 52.12,13.03 U$2.P$14
SCK
  Top 0.152: J5.3 76.5,2.97 76.35,2.97 75.59,2.21 40.54,2.21 39.62,3.12 39.09,3.12 36.88,5.33 U$2.P$18
SCL  (via drill 0.3)
  Top 0.152: RN2.3 56.01,25.45 56.01,24.92 57.61,23.32 57.61,22.63 57,22.02 53.19,22.02 52.12,23.09 U$2.P$10 | JP2.4 28.96,32.38 32.84,36.27 34.59,36.27 35.66,37.34 35.66,38.94 36.35,39.62 37.41,39.62 43.13,33.91 v43.13,33.53
  Bottom 0.152: 45.45,34.1 45.41,34.06 45.41,32.23 46.63,31.01 R101.1 46.71,30.94 47.4,30.25 47.4,30.18 50.67,26.9 52.65,26.9 53.34,26.21 53.34,24.38 U$2.P$10 52.05,23.09 51.66,22.71 48.01,22.71 RZ1.1 47.93,22.63 44.5,19.2 44.5,6.02 J1.3 | 45.45,34.1 46.33,34.98 46.33,35.97 Q1.3 | v43.13,33.53 43.36,33.53 44.2,34.37 45.19,34.37 45.45,34.1
SCL3V  (via drill 0.3)
  Top 0.152: v45.72,29.41 45.72,32.84 48.31,35.43 v48.31,35.97
  Bottom 0.152: 48.27,35.93 46.71,37.49 46.71,41 R102.1 46.63,41.07 46.02,41.68 46.02,44.96 J11.4 | 48.27,35.93 48.46,35.74 48.46,35.05 Q1.2 | v45.72,29.41 47.93,27.2 47.93,24.38 RZ1.2 | v48.31,35.97 48.27,35.93
SDA  (via drill 0.3)
  Top 0.152: 41,12.42 41,7.47 42.44,6.02 J1.2 | 41,12.42 v41,14.63 | v43.51,29.41 v43.51,31.17 42.82,31.17 39.47,34.52 v39.24,34.52 | v46.63,15.16 46.63,14.86 46.1,14.33 46.1,13.64 47.32,12.42 47.4,12.42 47.93,11.89 47.93,11.12 47.4,10.59 44.58,10.59 42.75,12.42 41,12.42
  Bottom 0.152: RN2.2 55.93,27.96 55.93,27.36 53.95,25.38 53.95,22.48 52.12,20.65 U$2.P$11 52.05,20.57 v46.63,15.16 | Q2.3 42.6,35.97 42.6,31.24 42.37,31.01 R103.1 42.6,31.17 v43.51,31.17 | v41,14.63 41,22.63 RZ2.1 41.07,22.63 43.51,25.07 v43.51,29.41 | JP2.5 34.21,32.38 36.35,34.52 v39.24,34.52
SDA3V
  Bottom 0.152: J11.3 44.96,44.96 44.96,43.66 42.37,41.07 R104.1 42.29,41 42.29,40.84 40.54,39.09 40.54,36.96 Q2.2 40.46,36.88 39.78,36.2 39.78,31.93 37.41,29.57 36.5,29.57 33.6,26.67 33.6,25.6 34.82,24.38 41,24.38 RZ2.2
THS
  Top 0.152: 8.57,43.55 10.97,45.95 U1.2 | 8.57,43.55 8.53,43.51 7.01,43.51 R9*.1 | U$2.P$26 36.88,25.76 36.88,26.52 38.1,27.74 38.1,36.35 37.34,37.11 35.89,37.11 32.38,33.6 30.63,33.6 29.79,32.77 29.79,31.93 28.04,30.18 25.15,30.18 22.71,27.74 19.05,27.74 13.26,33.53 13.26,36.5 8.61,41.15 8.61,43.51 8.57,43.55
TX  (via drill 0.3)
  Top 0.152: v53.34,13.87 v55.93,16.46
  Bottom 0.152: v55.93,16.46 59.13,16.46 60.58,17.91 60.58,19.28 61.49,20.19 61.49,46.63 59.51,48.62 59.21,48.62 IC1.1 | v53.34,13.87 53.34,11.73 52.12,10.52 U$2.P$15
V+  (via drill 0.3)
  Top 0.61: 4.46,7.96 4.5,8 v9.14,8 | 4.46,7.96 3.28,6.78 2.52,6.78 JP1.1 | v5.94,30.25 6.17,30.48 12.8,30.48 14.25,29.03 14.63,29.03 D1.C | v5.03,32.54 2.06,29.57 2.06,11.43 3.73,9.75 3.73,8.69 4.46,7.96
  Bottom 0.61: 29.57,9.45 30.71,10.59 30.71,12.95 C1.1 | 29.57,9.45 29.57,5.49 30.48,4.57 V1.IN | v9.14,8 13.79,12.65 13.79,13.72 J0.3 14.02,13.95 19.2,13.95 20.12,13.03 21.95,13.03 C2.1 22.25,12.95 24.69,12.95 28.04,9.6 29.34,9.6 29.57,9.45 | v5.94,30.25 5.94,31.62 v5.03,32.54
VCC  (via drill 0.3)
  Top 0.508: R9*.2 10.97,48.54 U1.3 | v42.06,32.69 44.81,32.69 v45.95,33.83 46.02,34.06 46.02,42.98 50.98,47.93 55.85,47.93 C7.1 56.01,47.7 57.91,47.7 58.06,47.55 65.68,47.55 66.75,48.62 IC1.14 67.06,48.69 67.36,49 70.71,49 C5.1 | K1.2 21.49,23.47 22.78,23.47 29.03,17.22 35.97,17.22 36.8,18.06 U$2.P$23 | v27.13,27.96 26.14,28.96 25.76,28.96 D2.C | 56.69,15.32 56.01,15.32 C6.1 | 56.69,15.32 59.13,17.75 OK1.8 | v58.14,30.4 57.99,30.56 56.01,30.56 RN2.1 | 56.69,15.32 56.77,15.09 57.07,14.78 57.07,9.45 59.97,6.55 59.97,6.02 J2.2 59.97,5.79 v59.97,4.19 | R12.2 41.99,11.43 43.05,11.43 48.46,6.02 J1.5
  Bottom 0.508: R9*.2 6.93,48.54 2.13,43.74 2.13,11.96 3.66,10.44 3.66,8.91 4.95,7.62 4.95,6.78 JP1.3 5.18,6.55 6.02,6.55 9.98,2.59 33.98,2.59 34.29,2.9 34.52,2.97 | v42.06,32.69 40.69,31.32 40.69,31.01 R103.2 | v45.95,33.83 45.95,33.68 48.31,31.32 48.31,31.01 R101.2 | JP2.1 21.26,32.38 24.61,29.03 25.68,29.03 D2.C | v27.13,27.96 27.13,27.74 28.27,26.59 28.27,25.6 27.28,24.61 22.55,24.61 21.49,23.55 K1.2 | OK1.8 59.21,17.83 60.05,18.67 60.05,23.39 58.98,24.46 58.98,25.45 R7.1 59.13,25.68 60.05,26.59 60.05,28.5 58.29,30.25 | 58.29,30.25 v58.14,30.4 | 59.97,3.96 50.52,3.96 48.54,5.94 J1.5 48.23,5.94 47.02,4.72 39.32,4.72 37.11,2.52 34.98,2.52 34.52,2.97 | 59.97,3.96 74.37,3.96 74.98,3.35 74.98,3.28 75.21,3.05 J5.2 | v59.97,4.19 59.97,3.96 | 34.52,2.97 34.52,15.16 36.8,17.45 36.8,18.06 U$2.P$23 | 58.29,30.25 60.96,32.92 60.96,46.48 60.27,47.17 58.45,47.17 57.91,47.7 56.01,47.7 C7.1
VCC/2  (via drill 0.3)
  Top 0.61: 8.53,22.17 8.53,23.01 9.68,24.16 SV1.8 | 8.53,22.17 8.53,21.18 9.68,20.04 9.68,19.2 SV1.4 | 8.53,22.17 5.49,22.17 4.72,22.94 4.72,28.04 5.94,29.26 9.68,29.26 SV1.12 | v44.58,33.53 44.27,33.53 36.88,40.92 U$2.P$32 | v35.28,3.28 34.52,2.52 15.01,2.52 10.82,6.71 7.54,6.71 JP1.5
  Bottom 0.61: SV1.12 9.68,29.34 9.68,29.95 8.53,31.09 8.53,33.22 9.68,34.37 SV1.16 | JP1.5 7.54,6.78 7.54,7.54 11.05,11.05 11.05,17.07 11.89,17.91 12.72,17.91 13.49,18.67 13.49,19.66 12.8,20.34 10.9,20.34 9.75,19.2 SV1.4 | v44.58,33.53 44.58,24.16 41.99,21.57 41.99,14.02 R11.2 41.83,13.72 39.17,11.05 39.17,5.64 36.8,3.28 v35.28,3.28
VDD  (via drill 0.3)
  Top 0.152: U$2.P$33 36.88,43.43 v39.24,41.07 v41.99,38.33
  Bottom 0.152: 42.02,36.61 42.06,36.65 46.94,36.65 47.78,35.81 47.78,34.59 48.01,34.37 49,34.37 49.23,34.59 49.23,36.2 48.54,36.88 Q1.1 48.46,36.96 48.39,37.03 48.39,41 R102.2 | 42.02,36.61 41.91,36.5 41.91,36.42 40.54,35.05 Q2.1 | J11.2 43.97,44.96 43.97,44.35 40.69,41.07 R104.2 40.62,41.07 v39.24,41.07 | v41.99,38.33 41.99,36.65 42.02,36.61
VIN  (via drill 0.3)
  Top 0.61: v39.32,3.66 39.32,5.33 38.33,6.33 38.33,8.99 36.88,10.44 U$2.P$20
  Bottom 0.61: v39.32,3.66 37.41,1.75 8.23,1.75 3.73,6.25 3.73,7.24 2.52,8.46 2.52,9.22 JP1.2
VOUT  (via drill 0.3)
  Top 0.61: JP1.4 5.03,9.3 7.47,9.3 JP1.6 | v11.81,35.59 9.22,35.59 3.5,29.87 3.5,17.45 6.93,14.02 6.93,9.53 JP1.6 | 22.02,8 22.02,8.99 C3.1 | 22.02,8 25.45,4.57 V1.OUT 25.68,4.72 29.95,8.99 30.71,8.99 C4.1 30.94,8.76 38.02,1.68 80.47,1.68 81.38,2.59 81.38,3.35 78.49,6.25 v77.42,6.25 | v70.71,6.25 69.19,4.72 67.44,4.72 66.22,5.94 66.06,5.94 J3.2 | JP1.6 7.85,9.22 9.45,9.22 12.27,6.4 20.34,6.4 21.79,7.85 22.02,8
  Bottom 0.61: v11.81,35.59 12.8,35.59 13.64,34.75 13.64,32.84 17.45,29.03 22.25,29.03 D1.A | v77.42,6.25 v70.71,6.25

### Text on the board
tNames: 104 | MC1 | USB | 472 | Arduino Micro | 102 | MIDI-OUT | 103 | LM35 or / DS18B20* | 74LS06 | 1S3 | Ichi Kanaya, Ph.D. | SparkFun RTC 12708 | How to make | 4.7k | 1S3 | 1S3 | 221 | MIDI-IN | 102 | 221 | 473 | 221 | MIDI-OUT | G5V-1 | IN | OUT | C1815 | 10k | pineapple.cc/card | L00 | R10 | TLP2630 | 105 | R11 | 22u | 103 | (backside) | 474 | 104 | 7805 | MIDI-IN | MKR | GPIO | Vout | I | V | C | O | R | G | 5V | 12V | SPI | (backside) | JST-PH | JST-PH | 12V | Pineapple IIc 2.6.5-RC | G | SD | SC | D7 | 5V | Half-Pitch
bNames: 4-M2.5 | Ichi Kanaya / Founder, Pineapple Computer / Founder, TEDxSaikai / Professor, Nagasaki Univ. / https://pineapple.cc/card / kanaya@pineapple.cc, @kanaya | Qwiic/3.3V | JST-SH | MIDI Out | 1: NC | 2-BSS138 | A3 | 2: GND | 3: NC | V/2 | Vcc | GND | NC | SCL | SDA | 4-102 (2012) | 4: Send | D12 | G | A2 | 5: Return | V/2 | D10 | G | D: Dual, S: Single / A: Ard., 5: D5V / (Bottom view) | GND | 5 | V/2 | A1 | A | D9 | G | MIDI In | 1: NC | V/2 | A0 | S | Danger Zone | 2: NC | D6 | G | D | Vcc | 3: NC | Vout | 221 | 4: Send | 472 | LED00 | 5: Return | Vin | Vout | V+ | Vin | 3mm | V+ | V/2 | Vcc | Vout | V+ | MI | V | SC | MO | R | G | SPI | Install J1 on this side | JST-PH | GPIO | Vout | 89x51mm | 3mm | G1 | G0 | V | G | Vo | G